# EasyEDA schematic Capteur Main P2.json
TITLE: Capteur Hand P2; REV: 1.0; Date: 2020-07-13; Sheet: 1/1; Company: Your Company
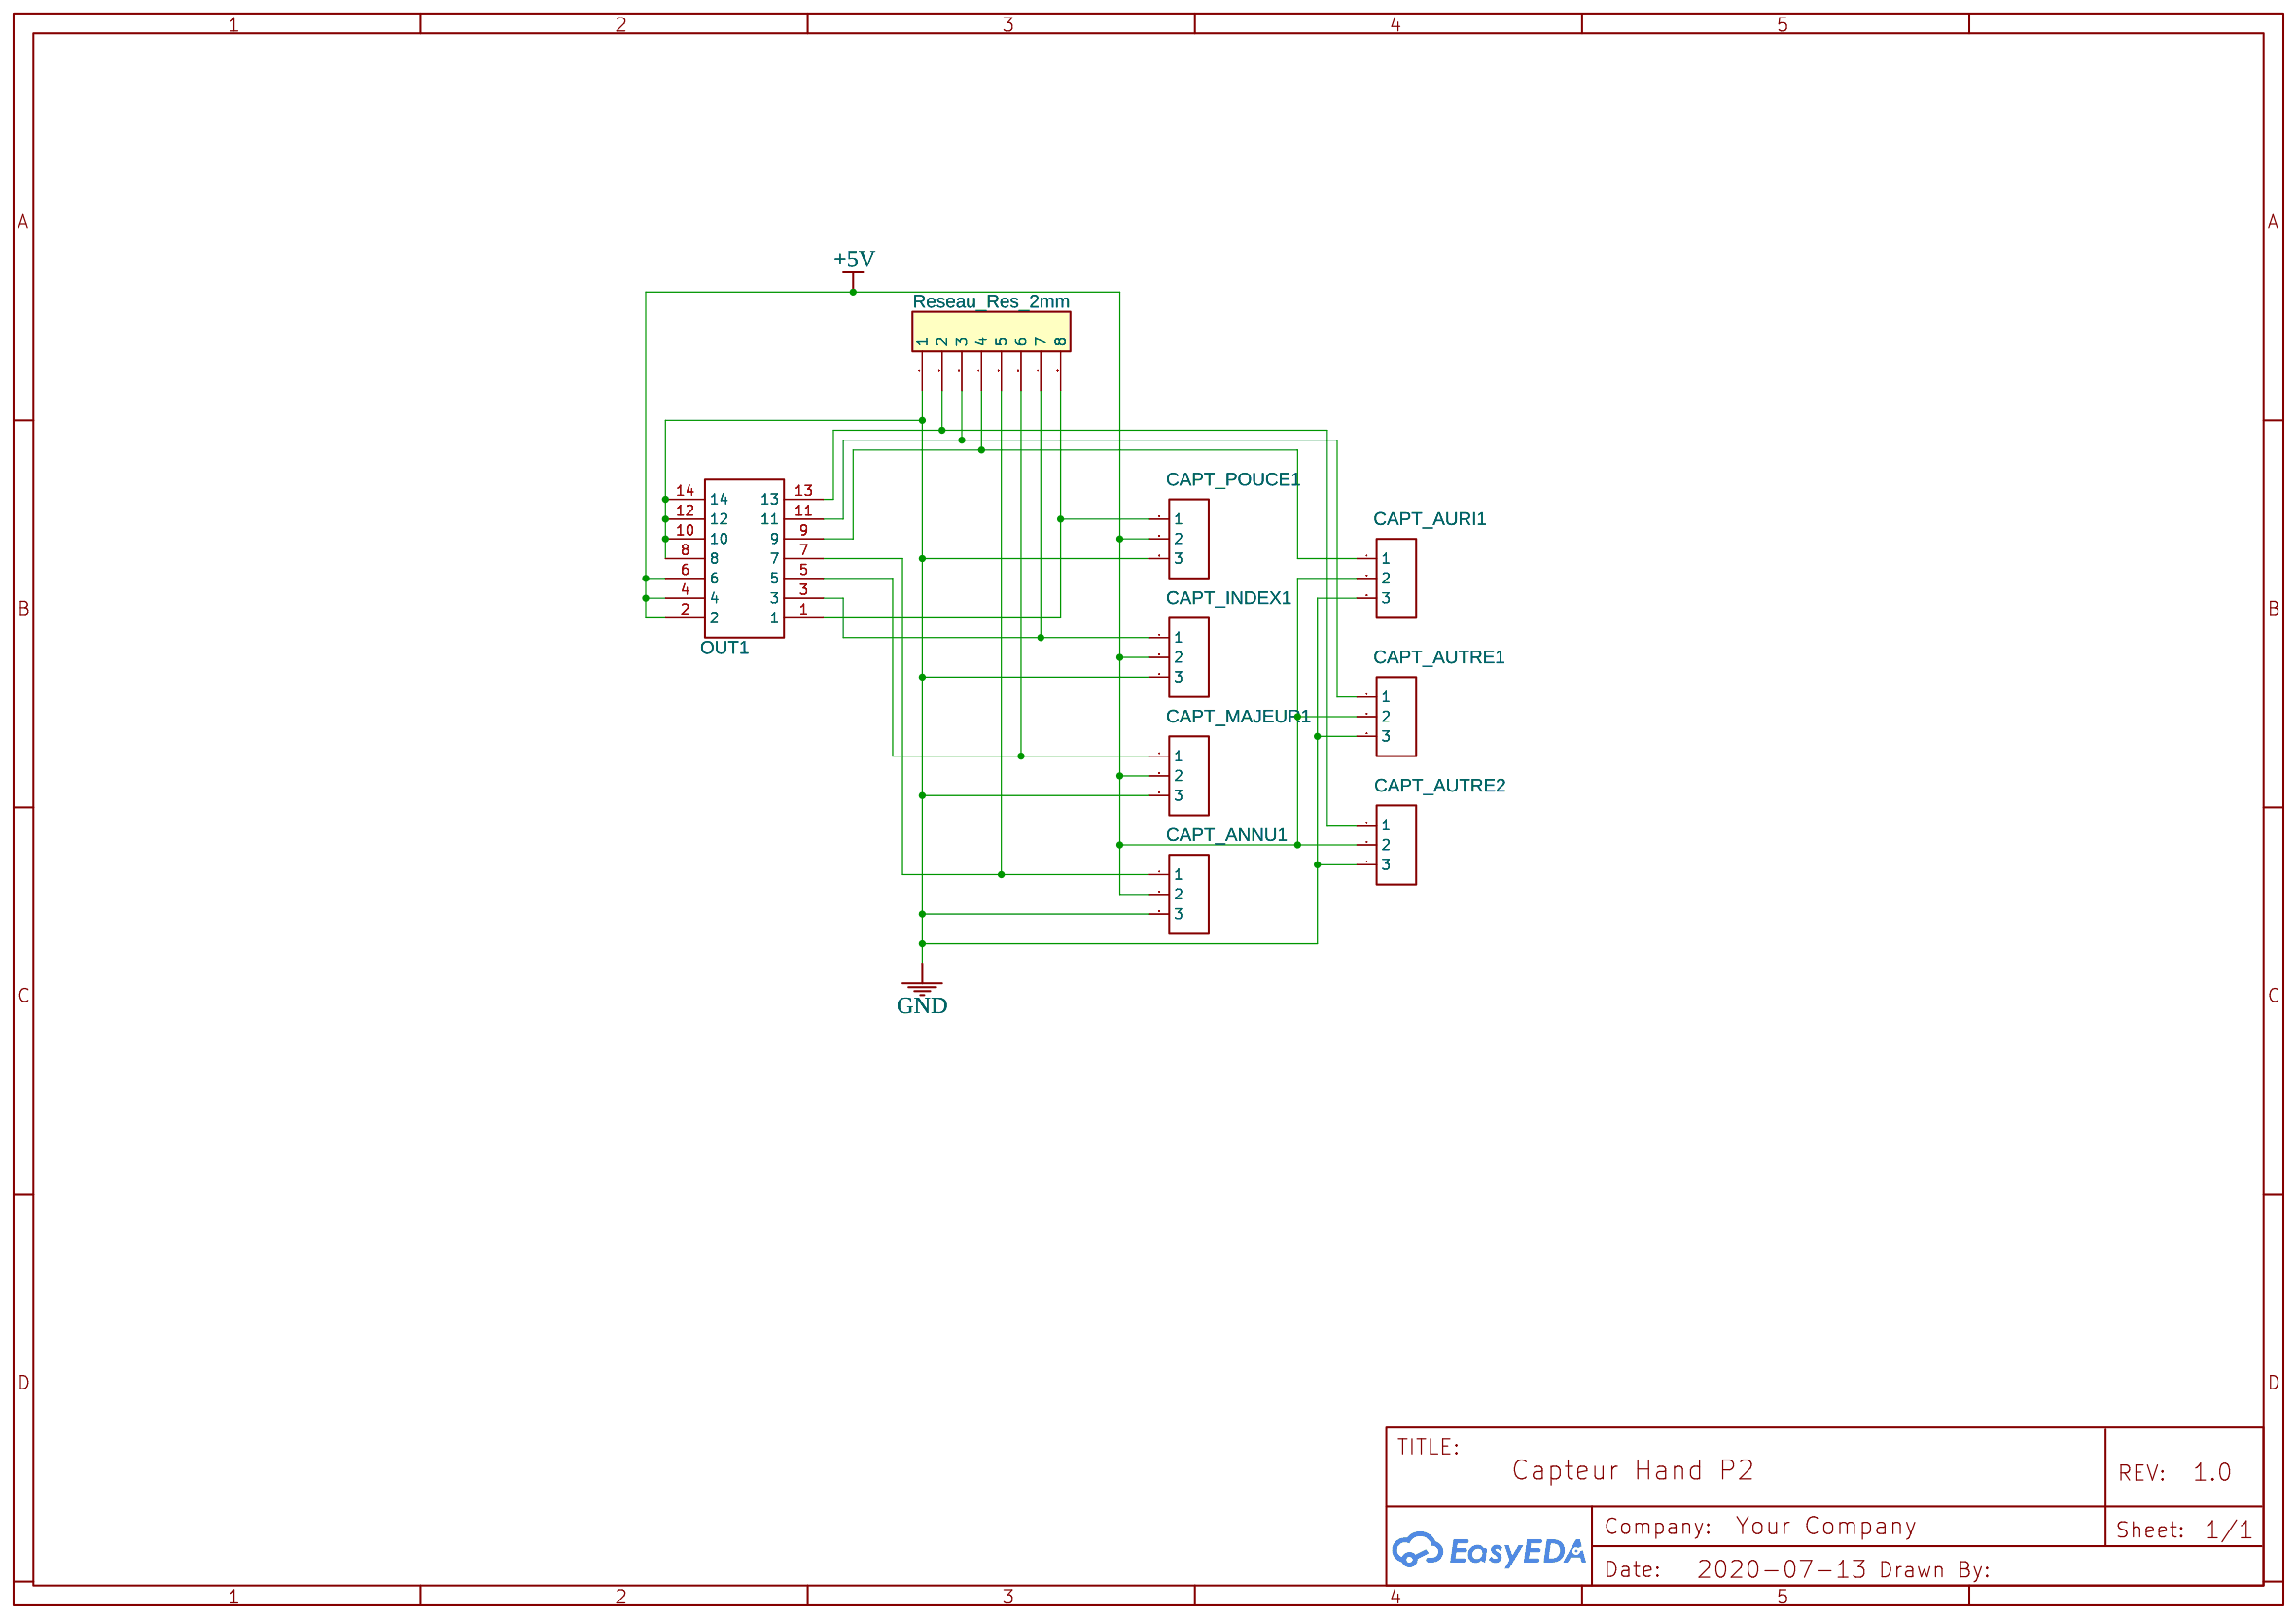
[diagram p0: schematic sheet]

## Parts
CAPT_ANNU1  1  [HDR-TH_3P-P2.54-V]
CAPT_AURI1  1  [HDR-TH_3P-P2.54-V]
CAPT_AUTRE1  1  [HDR-TH_3P-P2.54-V]
CAPT_AUTRE2  1  [HDR-TH_3P-P2.54-V]
CAPT_INDEX1  1  [HDR-TH_3P-P2.54-V]
CAPT_MAJEUR1  1  [HDR-TH_3P-P2.54-V]
CAPT_POUCE1  1  [HDR-TH_3P-P2.54-V]
OUT1  Horn connector/2.0mm2*7P  [IDC-TH_14P-P2.00-V-M-R2-C7-S2.00]
P1  Reseau_Res_2mm  [RESEAU7R_2MM]

## Library data of the parts
CAPT_ANNU1 CAPT_AURI1 CAPT_AUTRE1 CAPT_AUTRE2 CAPT_INDEX1 CAPT_MAJEUR1 CAPT_POUCE1 = Header-Male-2.54_1x3: Supplier: LCSC; Manufacturer: BOOMELE; Manufacturer Part: Header2.54mm 1*3P; image: //image.lceda.cn/szlcsc/C49257.jpg; Supplier Part: C49257
OUT1 = Horn connector/2.0mm2*7P: Supplier: LCSC; Manufacturer: BOOMELE; Manufacturer Part: Horn connector/2.0mm2*7P直简牛; Supplier Part: C29428
P1 = Reseau7R_2mm: Contributor: mrilic66; Package Display: No

## Nets
+5V: CAPT_ANNU1.2 CAPT_AURI1.2 CAPT_AUTRE1.2 CAPT_AUTRE2.2 CAPT_INDEX1.2 CAPT_MAJEUR1.2 CAPT_POUCE1.2 OUT1.2 OUT1.4 OUT1.6
GND: CAPT_ANNU1.3 CAPT_AURI1.3 CAPT_AUTRE1.3 CAPT_AUTRE2.3 CAPT_INDEX1.3 CAPT_MAJEUR1.3 CAPT_POUCE1.3 OUT1.8 OUT1.10 OUT1.12 OUT1.14 P1.1
Net-(CAPT_ANNU1-1): CAPT_ANNU1.1 OUT1.7 P1.5
Net-(CAPT_AURI1-1): CAPT_AURI1.1 OUT1.9 P1.4
Net-(CAPT_AUTRE1-1): CAPT_AUTRE1.1 OUT1.11 P1.3
Net-(CAPT_AUTRE2-1): CAPT_AUTRE2.1 OUT1.13 P1.2
Net-(CAPT_INDEX1-1): CAPT_INDEX1.1 OUT1.3 P1.7
Net-(CAPT_MAJEUR1-1): CAPT_MAJEUR1.1 OUT1.5 P1.6
Net-(CAPT_POUCE1-1): CAPT_POUCE1.1 OUT1.1 P1.8
